# EAGLE design gorrazoptere_v0_9 (EAGLE 4.16)
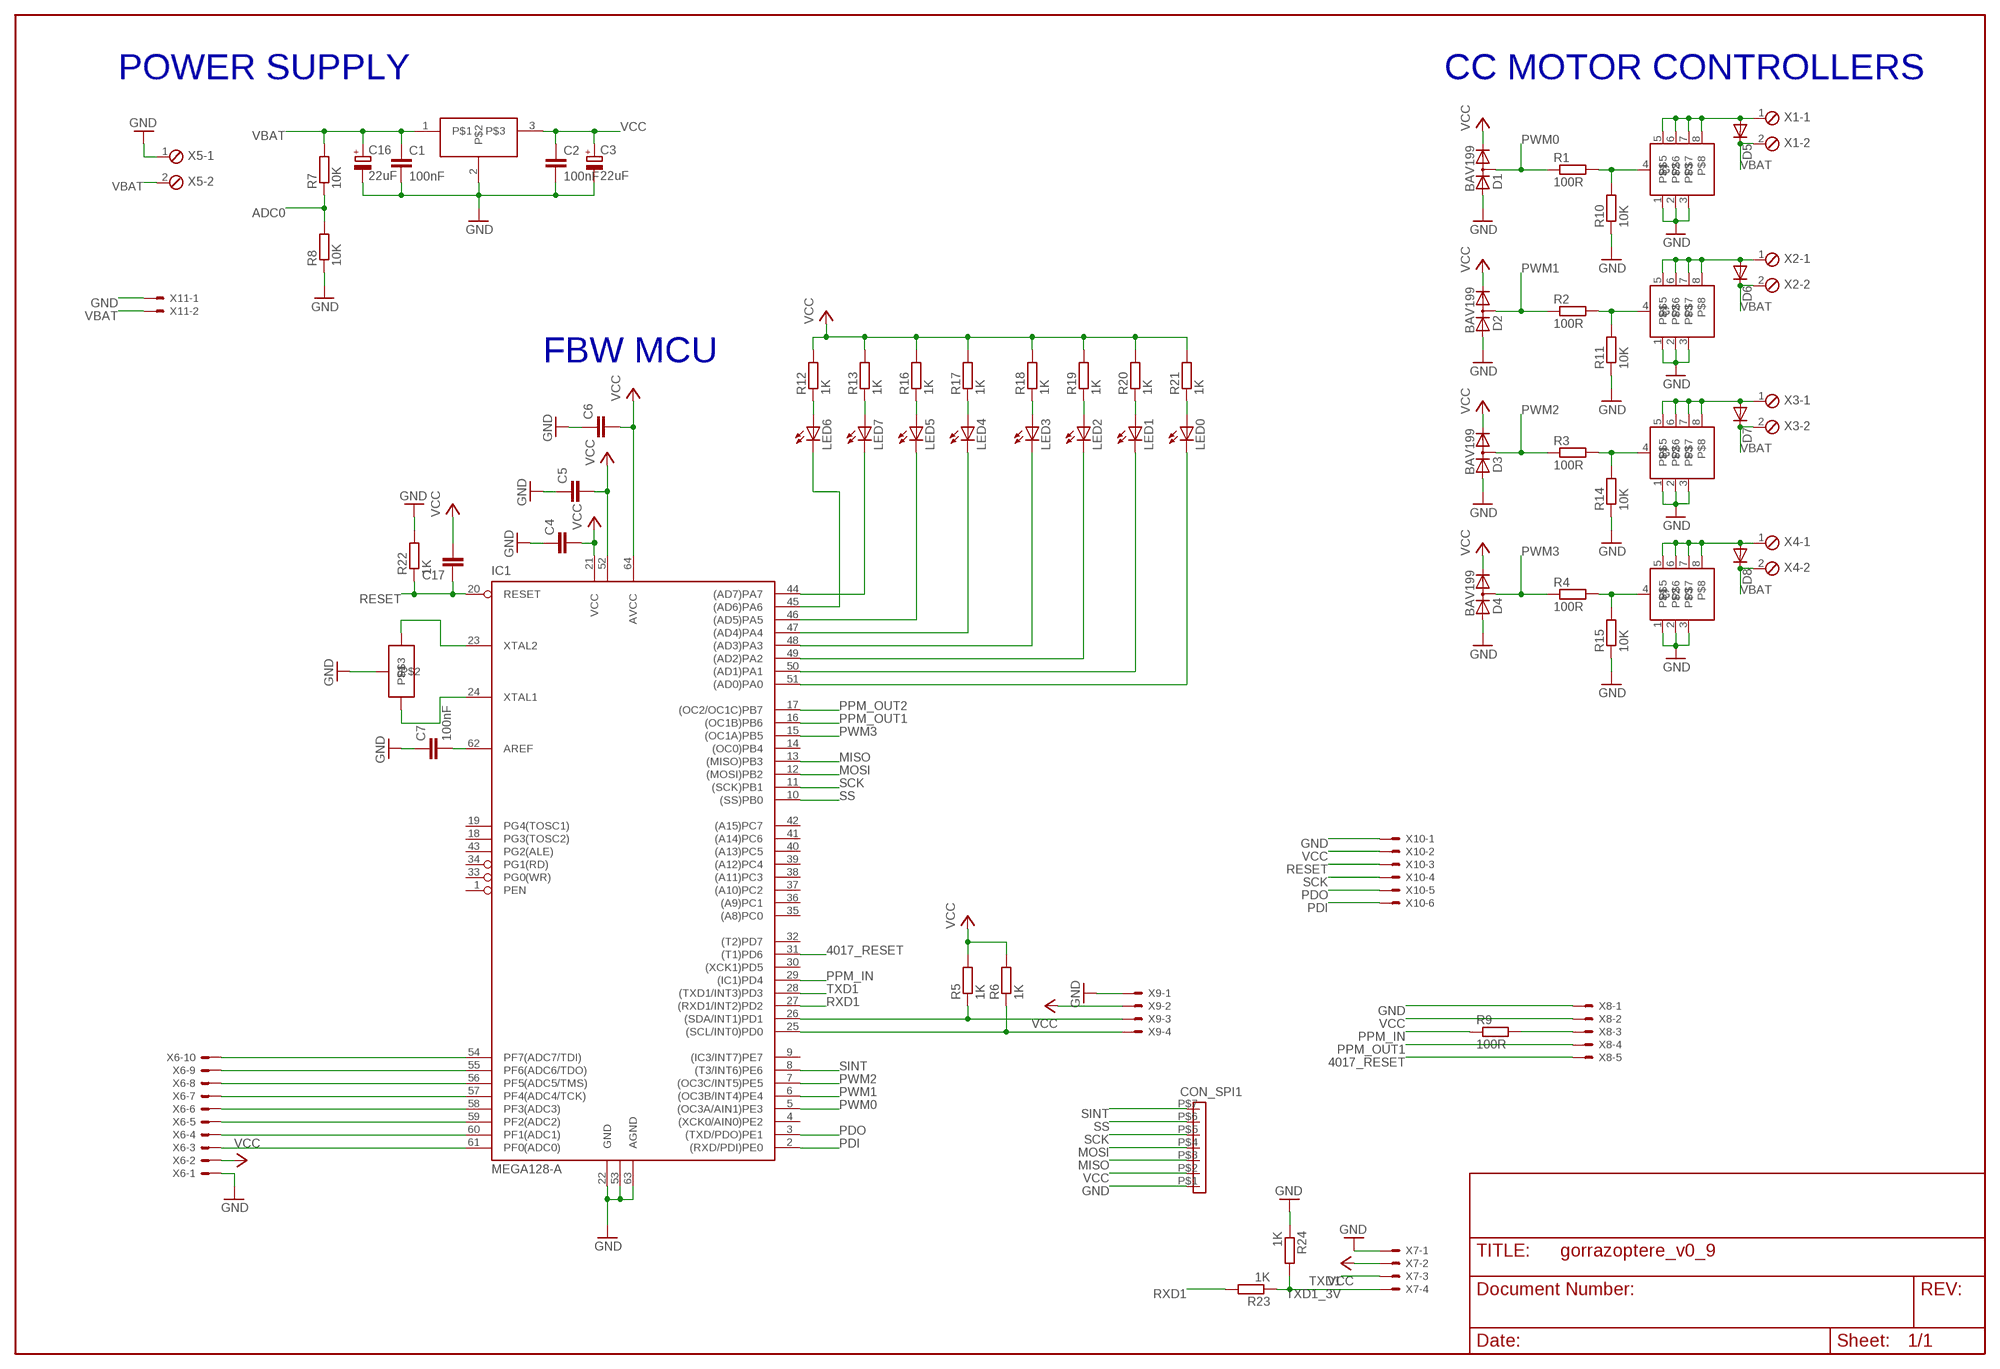
[diagram p0: schematic, sheet 1]

## Parts
C1  100nF  C-EUC0603  [C0603]
C2  100nF  C-EUC0603  [C0603]
C3  22uF  CPOL-EUD/7343-31R  [D/7343-31R]
C4  C-EUC0603  [C0603]
C5  C-EUC0603  [C0603]
C6  C-EUC0603  [C0603]
C7  100nF  C-EUC0603  [C0603]
C16  22uF  CPOL-EUD/7343-31R  [D/7343-31R]
C17  C-EUC0603  [C0603]
CON_SPI1  CON_MOLEX_7  [CON_MOLEX_7]
D1  BAV199  [SOT23]
D2  BAV199  [SOT23]
D3  BAV199  [SOT23]
D4  BAV199  [SOT23]
D5  DIODE-DO214BA  [DO-214BA]
D6  DIODE-DO214BA  [DO-214BA]
D7  DIODE-DO214BA  [DO-214BA]
D8  DIODE-DO214BA  [DO-214BA]
IC1  MEGA128-A  [TQFP64-AEB]
LED0  LEDCHIP-LED0805  [CHIP-LED0805]
LED1  LEDCHIP-LED0805  [CHIP-LED0805]
LED2  LEDCHIP-LED0805  [CHIP-LED0805]
LED3  LEDCHIP-LED0805  [CHIP-LED0805]
LED4  LEDCHIP-LED0805  [CHIP-LED0805]
LED5  LEDCHIP-LED0805  [CHIP-LED0805]
LED6  LEDCHIP-LED0805  [CHIP-LED0805]
LED7  LEDCHIP-LED0805  [CHIP-LED0805]
R1  100R  R-EU_R0603  [R0603]
R2  100R  R-EU_R0603  [R0603]
R3  100R  R-EU_R0603  [R0603]
R4  100R  R-EU_R0603  [R0603]
R5  1K  R-EU_R0603  [R0603]
R6  1K  R-EU_R0603  [R0603]
R7  10K  R-EU_R0603  [R0603]
R8  10K  R-EU_R0603  [R0603]
R9  100R  R-EU_R0603  [R0603]
R10  10K  R-EU_R0603  [R0603]
R11  10K  R-EU_R0603  [R0603]
R12  1K  R-EU_R0603  [R0603]
R13  1K  R-EU_R0603  [R0603]
R14  10K  R-EU_R0603  [R0603]
R15  10K  R-EU_R0603  [R0603]
R16  1K  R-EU_R0603  [R0603]
R17  1K  R-EU_R0603  [R0603]
R18  1K  R-EU_R0603  [R0603]
R19  1K  R-EU_R0603  [R0603]
R20  1K  R-EU_R0603  [R0603]
R21  1K  R-EU_R0603  [R0603]
R22  1K  R-EU_R0603  [R0603]
R23  1K  R-EU_R0603  [R0603]
R24  1K  R-EU_R0603  [R0603]
U$1  MICRO_RESO  [MICRO_CRYSTAL]
U$2  7805  [TO220H]
U$4  IRF7809  [SO08]
U$5  IRF7809  [SO08]
U$6  IRF7809  [SO08]
U$7  IRF7809  [SO08]
X1  MPT2  [2POL254]
X2  MPT2  [2POL254]
X3  MPT2  [2POL254]
X4  MPT2  [2POL254]
X5  MPT2  [2POL254]
X6  53047-10  [53047-10]
X7  53047-04  [53047-04]
X8  53047-05  [53047-05]
X9  53047-04  [53047-04]
X10  53047-06  [53047-06]
X11  53047-02  [53047-02]

## Nets
4017_RESET: IC1.31((T1)PD6) X8.5
ADC0: IC1.61(PF0(ADC0)) R7.1 R8.2 X6.3
ADC1: IC1.60(PF1(ADC1)) X6.4
ADC2: IC1.59(PF2(ADC2)) X6.5
ADC3: IC1.58(PF3(ADC3)) X6.6
ADC4: IC1.57(PF4(ADC4/TCK)) X6.7
ADC5: IC1.56(PF5(ADC5/TMS)) X6.8
ADC6: IC1.55(PF6(ADC6/TDO)) X6.9
ADC7: IC1.54(PF7(ADC7/TDI)) X6.10
GND: C1.2 C2.2 C3.- C4.1 C5.1 C6.1 C7.1 C16.- CON_SPI1.P$1 D1.1(A) D2.1(A) D3.1(A) D4.1(A) IC1.22(GND) IC1.53(GND1) IC1.63(AGND) R8.1 R10.1 R11.1 R14.1 R15.1 R22.2 R24.1 U$1.P$2 U$2.2 U$4.1 U$4.2 U$4.3 U$5.1 U$5.2 U$5.3 U$6.1 U$6.2 U$6.3 U$7.1 U$7.2 U$7.3 X5.1 X6.1 X7.1 X8.1 X9.1 X10.1 X11.1
MISO: CON_SPI1.P$3 IC1.13((MISO)PB3)
MOSI: CON_SPI1.P$4 IC1.12((MOSI)PB2)
N$1: IC1.23(XTAL2) U$1.P$3
N$2: IC1.24(XTAL1) U$1.P$1
N$3: IC1.26((SDA/INT1)PD1) R5.1 X9.3
N$4: IC1.25((SCL/INT0)PD0) R6.1 X9.4
N$5: IC1.45((AD6)PA6) LED6.C
N$7: R9.2 X8.3
N$9: R1.2 R10.2 U$4.4(G)
N$10: LED2.A R19.1
N$11: LED3.A R18.1
N$12: IC1.48((AD3)PA3) LED3.C
N$13: D5.A U$4.5 U$4.6 U$4.7 U$4.8 X1.1
N$14: D6.A U$5.5 U$5.6 U$5.7 U$5.8 X2.1
N$15: D7.A U$6.5 U$6.6 U$6.7 U$6.8 X3.1
N$16: D8.A U$7.5 U$7.6 U$7.7 U$7.8 X4.1
N$17: LED7.A R13.1
N$18: LED6.A R12.1
N$19: R2.2 R11.2 U$5.4(G)
N$20: R3.2 R14.2 U$6.4(G)
N$21: R4.2 R15.2 U$7.4(G)
N$22: LED4.A R17.1
N$23: C7.2 IC1.62(AREF)
N$25: IC1.44((AD7)PA7) LED7.C
N$26: LED5.A R16.1
N$27: IC1.46((AD5)PA5) LED5.C
N$28: IC1.47((AD4)PA4) LED4.C
N$29: IC1.49((AD2)PA2) LED2.C
N$30: LED0.A R21.1
N$31: LED1.A R20.1
N$32: IC1.50((AD1)PA1) LED1.C
N$33: IC1.51((AD0)PA0) LED0.C
PDI: IC1.2((RXD/PDI)PE0) X10.6
PDO: IC1.3((TXD/PDO)PE1) X10.5
PPM_IN: IC1.29((IC1)PD4) R9.1
PPM_OUT1: IC1.16((OC1B)PB6) X8.4
PPM_OUT2: IC1.17((OC2/OC1C)PB7)
PWM0: D1.3(AC) IC1.5((OC3A/AIN1)PE3) R1.1
PWM1: D2.3(AC) IC1.6((OC3B/INT4)PE4) R2.1
PWM2: D3.3(AC) IC1.7((OC3C/INT5)PE5) R3.1
PWM3: D4.3(AC) IC1.15((OC1A)PB5) R4.1
RESET: C17.1 IC1.20(RESET) R22.1 X10.3
RXD1: IC1.27((RXD1/INT2)PD2) R23.2
SCK: CON_SPI1.P$5 IC1.11((SCK)PB1) X10.4
SINT: CON_SPI1.P$7 IC1.8((T3/INT6)PE6)
SS: CON_SPI1.P$6 IC1.10((SS)PB0)
TXD1: IC1.28((TXD1/INT3)PD3) X7.3
TXD1_3V: R23.1 R24.2 X7.4
VBAT: C1.1 C16.+ D5.C D6.C D7.C D8.C R7.2 U$2.1 X1.2 X2.2 X3.2 X4.2 X5.2 X11.2
VCC: C2.1 C3.+ C4.2 C5.2 C6.2 C17.2 CON_SPI1.P$2 D1.2(C) D2.2(C) D3.2(C) D4.2(C) IC1.21(VCC) IC1.52(VCC1) IC1.64(AVCC) R5.2 R6.2 R12.2 R13.2 R16.2 R17.2 R18.2 R19.2 R20.2 R21.2 U$2.3 X6.2 X7.2 X8.2 X9.2 X10.2
Unconnected: IC1.1(PEN) IC1.4((XCK0/AIN0)PE2) IC1.9((IC3/INT7)PE7) IC1.14((OC0)PB4) IC1.18(PG3(TOSC2)) IC1.19(PG4(TOSC1)) IC1.30((XCK1)PD5) IC1.32((T2)PD7) IC1.33(PG0(WR)) IC1.34(PG1(RD)) IC1.35((A8)PC0) IC1.36((A9)PC1) IC1.37((A10)PC2) IC1.38((A11)PC3) IC1.39((A12)PC4) IC1.40((A13)PC5) IC1.41((A14)PC6) IC1.42((A15)PC7) IC1.43(PG2(ALE))

## Notes on the sheet
- POWER SUPPLY | CC MOTOR CONTROLLERS
- FBW MCU

## Library data of the parts
C1 C2 C4-C7 C17 = rcl:C-EU: CAPACITOR, European symbol
C3 C16 = rcl:CPOL-EU: POLARIZED CAPACITOR, European symbol
CON_SPI1 = misc_datalogger:CON_MOLEX_7
D1-D4 = diode:BAV199: DIODE low-leakage double diode
D5-D8 = diode:DIODE-: DIODE
IC1 = atmel:MEGA128: MICROCONTROLLER 128 Kbytes FLASH 4 Kbytes SRAM 4 Kbytes EEPROM DUAL USART 8-channel 10 bit ADC
LED0 LED1-LED7 = led:LED: LED OSRAM: - CHIPLED LG R971, LG N971, LY N971, LG Q971, LY Q971, LO R971, LY R971 LH N974, LH R974 LS Q976, LO Q976, LY Q976 LO Q996 - Hyper CHIPLED LW Q18S LB Q993, LB Q99A, LB R99A - SideLED LS A670, LO A670, LY A670, LG A670, LP A670 LB A673, LV A673, LT A673, LW A673 LH A674 LY A675 LS A676, LA A676, LO A676, LY A676, LW A676 LS A679, LY A679, LG A679 - Hyper Micro SIDELED® LS Y876, LA Y876, LO Y876, LY Y876 LT Y87S - SmartLED LW L88C, LW L88S LB L89C, LB L89S, LG L890 LS L89K, LO L89K, LY L89K LS L896, LA L896, LO L896, LY L896 - TOPLED LS T670, LO T670, LY T670, LG T670, LP T670 LSG T670, LSP T670, LSY T670, LOP T670, LYG T670 LG T671, LOG T671, LSG T671 LB T673, LV T673, LT T673, LW T673 LH T674 LS T676, LA T676, LO T676, LY T676, LB T676, LH T676, LSB T676, LW T676 LB T67C, LV T67C, LT T67C, LS T67K, LO T67K, LY T67K, LW E67C LS E67B, LA E67B, LO E67B, LY E67B, LB E67C, LV E67C, LT E67C LW T67C LS T679, LY T679, LG T679 LS T770, LO T770, LY T770, LG T770, LP T770 LB T773, LV T773, LT T773, LW T773 LH T774 LS E675, LA E675, LY E675, LS T675 LS T776, LA T776, LO T776, LY T776, LB T776 LHGB T686 LT T68C, LB T68C - Hyper Mini TOPLED® LB M676 - Mini TOPLED Santana® LG M470 LS M47K, LO M47K, LY M47K Source: http://www.osram.convergy.de/
R1-R24 = rcl:R-EU_: RESISTOR, European symbol
U$1 = paparazzi:MICRO_RESO
U$2 = paparazzi:7805
U$4-U$7 = paparazzi:IRF7809
X1-X5 = con-phoenix-254:MPT2: PHOENIX CONNECTOR
X6 = con-molex:53?-10: CONNECTOR wire to board 1.25 mm (.049 inch) pitch header
X7 X9 = con-molex:53?-04: CONNECTOR wire to board 1.25 mm (.049 inch) pitch header
X8 = con-molex:53?-05: CONNECTOR wire to board 1.25 mm (.049 inch) pitch header
X10 = con-molex:53?-06: CONNECTOR wire to board 1.25 mm (.049 inch) pitch header
X11 = con-molex:53?-02: CONNECTOR wire to board 1.25 mm (.049 inch) pitch header

## Board
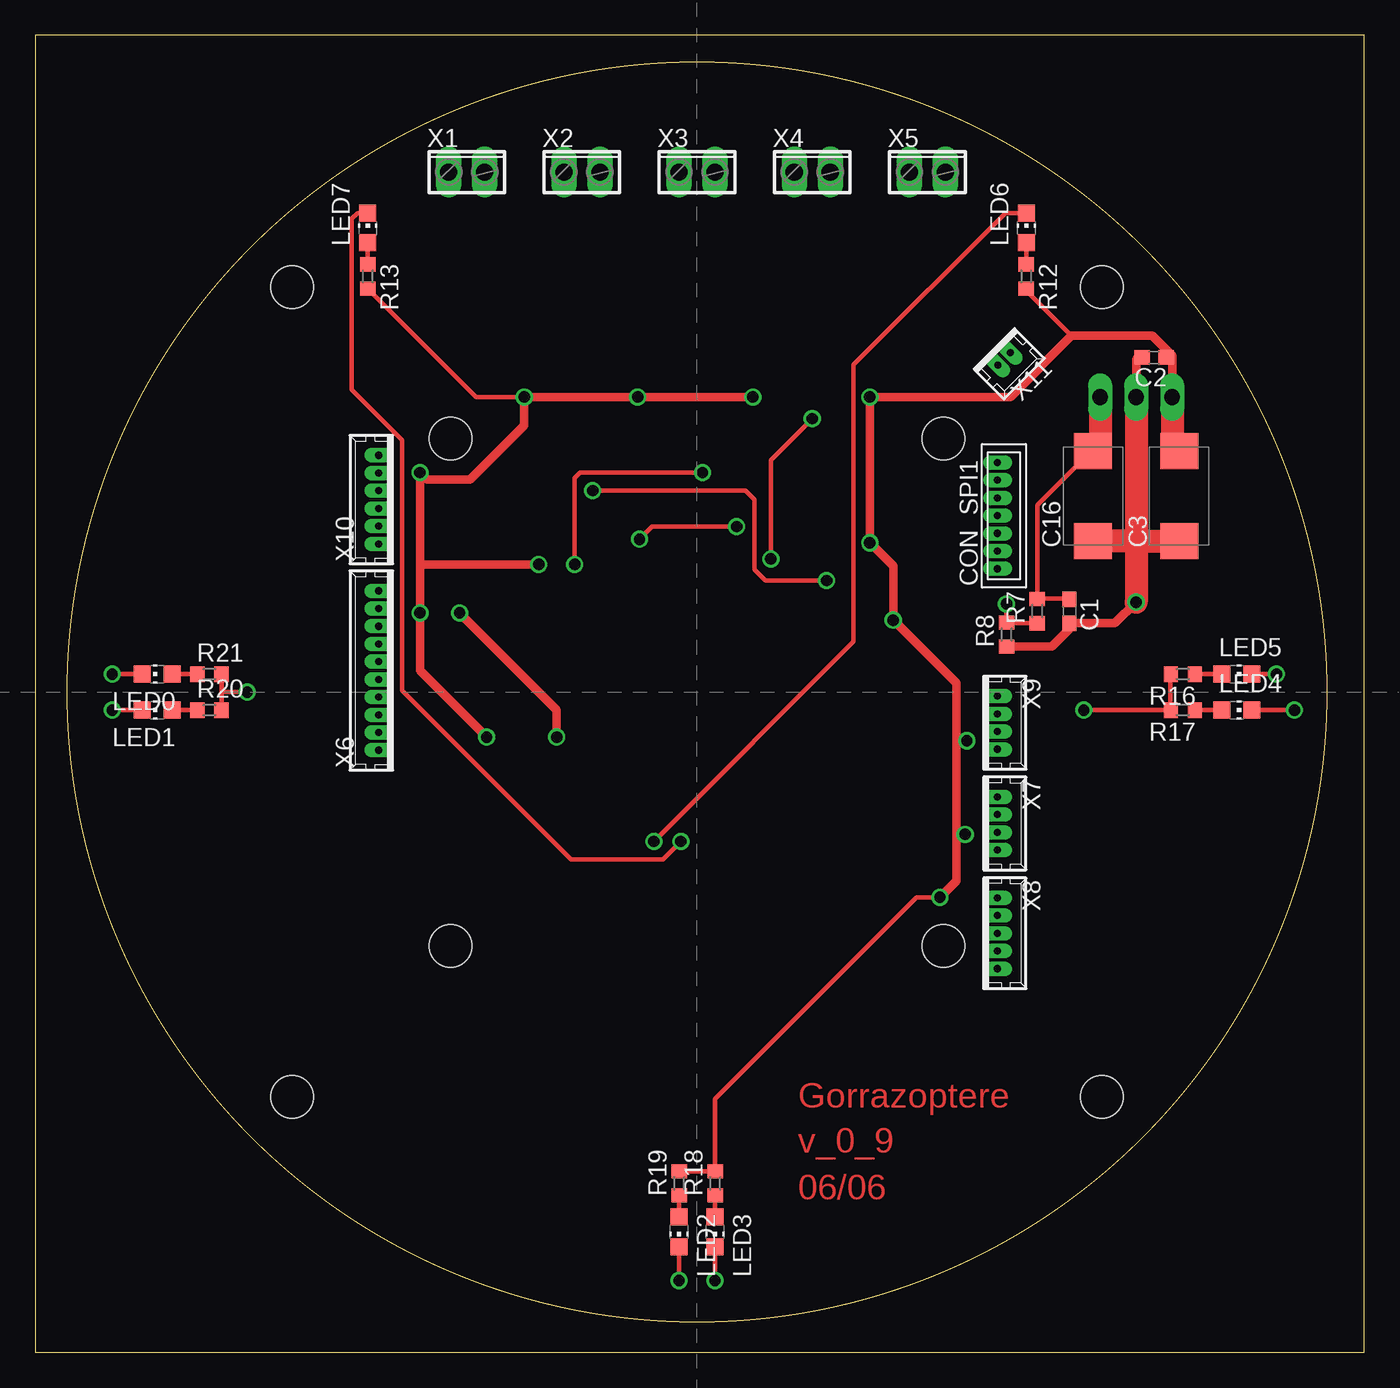
[diagram p1: board, top side]
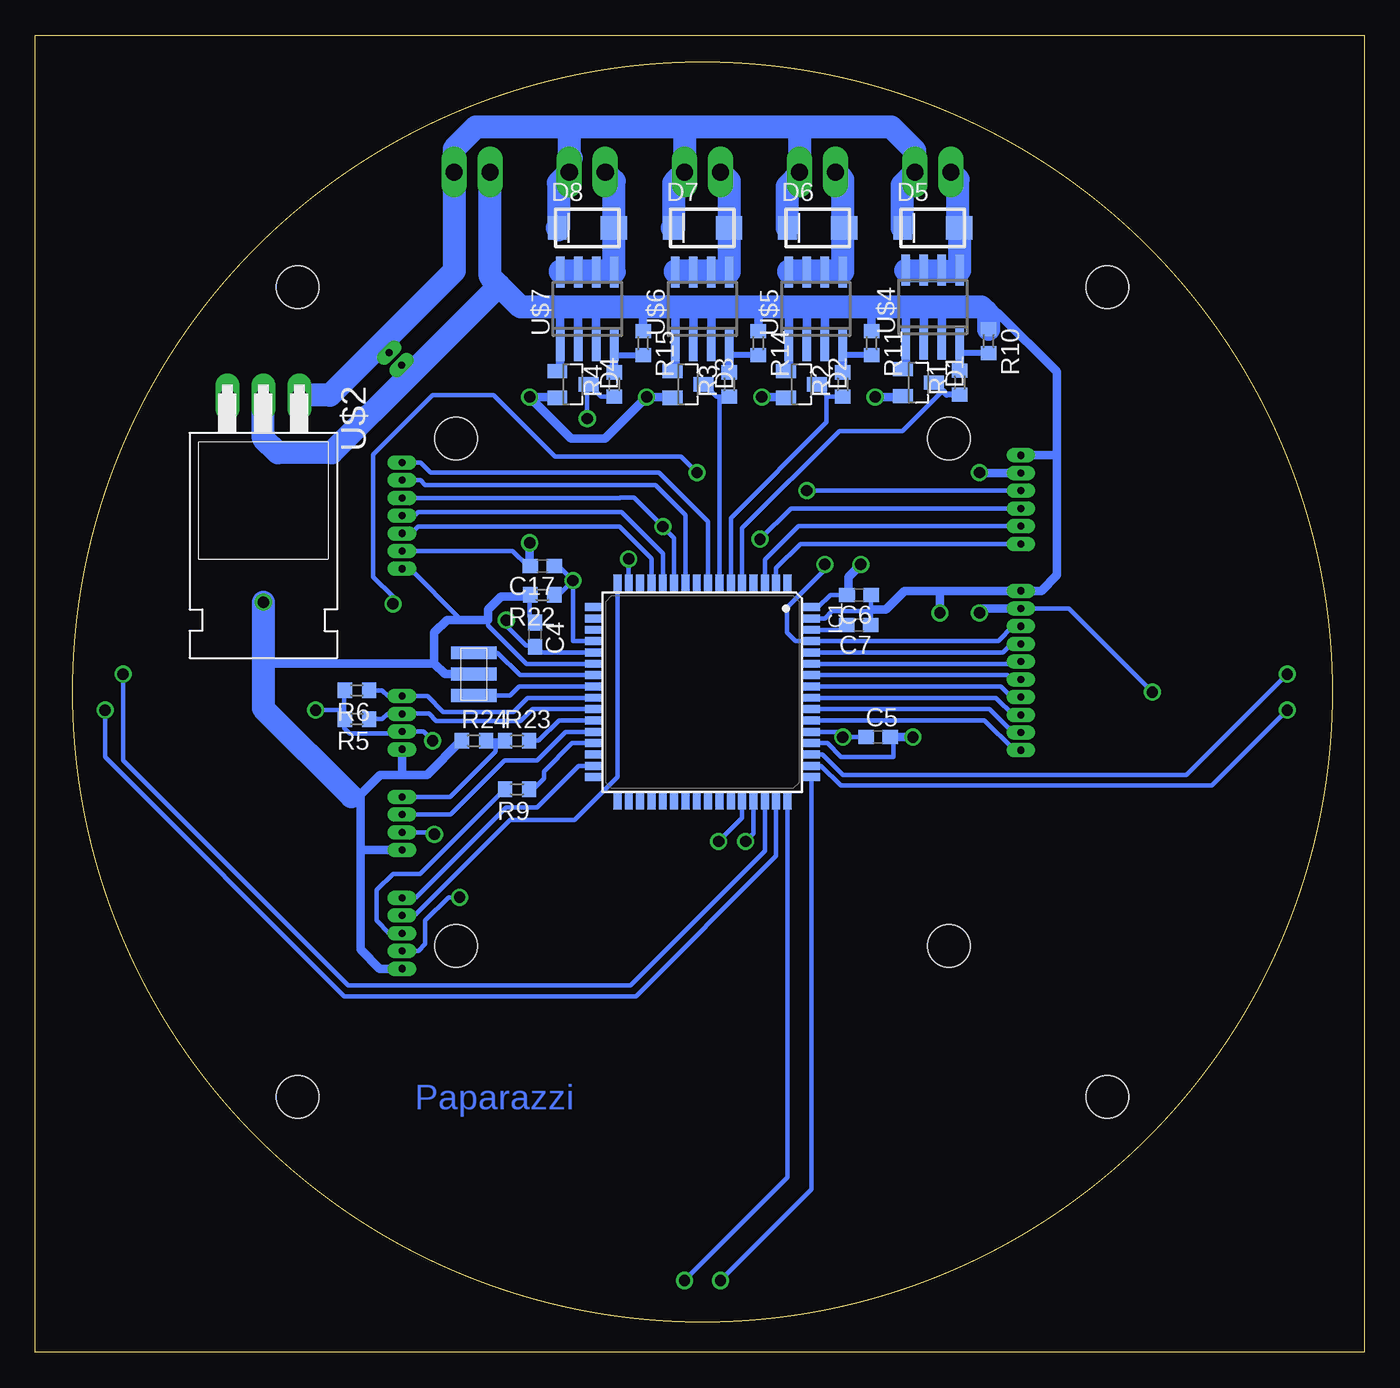
[diagram p2: board, bottom side, seen from below]

Size 93.78 x 92.95 mm. Coordinates in mm from the lower left corner, seen from the top.
Outline: 0,0 93.78,0 93.78,92.95 0,92.95 0,0
Outline: circle at 46.7,46.6 radius 44.45
Copper layers (1*16): Top 0.035mm / dielectric 1.5mm / Bottom 0.035mm
Design rules "default": minimum track width 10mil, minimum drill 24mil, track to track 8mil, track to pad 8mil, pad to pad 8mil, via to via 8mil, smd to smd 8mil, copper to edge 40mil, drill to drill 8mil, minimum pad ring 10mil, minimum via ring 8mil, stop-mask expansion 4mil, vias tented up to drill 0mil, thermal gap 10mil
Holes 3 mm at 18.12,75.18 75.27,75.18 75.27,18.03 18.12,18.03 29.3,64.51 64.1,64.51 64.1,28.7 29.3,28.7

### Footprints (pad centres in the part's own frame; a part is rotated, then mirrored left to right if it is on the bottom)
C0603 = smd 1.1 x 1: 1 -0.85,0; 2 0.85,0
D/7343-31R = smd 2.55 x 2.7: + 3.175,0; - -3.175,0
CON_MOLEX_7 = drill 0.5 pad 0.762 long: P$1 -3.74,0; P$2 -2.49,0; P$3 -1.24,0; P$4 0.01,0; P$5 1.26,0; P$6 2.51,0; P$7 3.76,0
SOT23 = smd 1 x 1.4: 1 -0.95,-1.1; 2 0.95,-1.1; 3 0,1.1
DO-214BA = smd 1.85 x 1.68: A 1.87,0 | smd 1.32 x 1.68: C -2.12,0
TQFP64-AEB = smd 1.194 x 0.559: 1 -7.7,6; 2 -7.7,5.2; 3 -7.7,4.4; 4 -7.7,3.6; 5 -7.7,2.8; 6 -7.7,2; 7 -7.7,1.2; 8 -7.7,0.4; 9 -7.7,-0.4; 10 -7.7,-1.2; 11 -7.7,-2; 12 -7.7,-2.8; 13 -7.7,-3.6; 14 -7.7,-4.4; 15 -7.7,-5.2; 16 -7.7,-6; 33 7.7,-6; 34 7.7,-5.2; 35 7.7,-4.4; 36 7.7,-3.6; 37 7.7,-2.8; 38 7.7,-2; 39 7.7,-1.2; 40 7.7,-0.4; 41 7.7,0.4; 42 7.7,1.2; 43 7.7,2; 44 7.7,2.8; 45 7.7,3.6; 46 7.7,4.4; 47 7.7,5.2; 48 7.7,6 | smd 0.559 x 1.194: 17 -6,-7.7; 18 -5.2,-7.7; 19 -4.4,-7.7; 20 -3.6,-7.7; 21 -2.8,-7.7; 22 -2,-7.7; 23 -1.2,-7.7; 24 -0.4,-7.7; 25 0.4,-7.7; 26 1.2,-7.7; 27 2,-7.7; 28 2.8,-7.7; 29 3.6,-7.7; 30 4.4,-7.7; 31 5.2,-7.7; 32 6,-7.7; 49 6,7.7; 50 5.2,7.7; 51 4.4,7.7; 52 3.6,7.7; 53 2.8,7.7; 54 2,7.7; 55 1.2,7.7; 56 0.4,7.7; 57 -0.4,7.7; 58 -1.2,7.7; 59 -2,7.7; 60 -2.8,7.7; 61 -3.6,7.7; 62 -4.4,7.7; 63 -5.2,7.7; 64 -6,7.7
CHIP-LED0805 = smd 1.2 x 1.2: A 0,-1.05; C 0,1.05
R0603 = smd 1 x 1.1: 1 -0.85,0; 2 0.85,0
MICRO_CRYSTAL = smd 0.9 x 3.2: P$1 -1.5,0; P$2 0,0; P$3 1.5,0
TO220H = drill 1.118 long: 1 -2.54,-10.16; 2 0,-10.16; 3 2.54,-10.16
SO08 = smd 0.6 x 2.2: 1 -1.905,-2.6; 2 -0.635,-2.6; 3 0.635,-2.6; 4 1.905,-2.6; 5 1.905,2.6; 6 0.635,2.6; 7 -0.635,2.6; 8 -1.905,2.6
2POL254 = drill 1.2 long: 1 -1.27,0; 2 1.27,0
53047-10 = drill 0.5 pad 0.698 long: 1 5.625,0; 2 4.375,0; 3 3.125,0; 4 1.875,0; 5 0.625,0; 6 -0.625,0; 7 -1.875,0; 8 -3.125,0; 9 -4.375,0; 10 -5.625,0
53047-04 = drill 0.5 pad 0.698 long: 1 1.875,0; 2 0.625,0; 3 -0.625,0; 4 -1.875,0
53047-05 = drill 0.5 pad 0.698 long: 1 2.5,0; 2 1.25,0; 3 0,0; 4 -1.25,0; 5 -2.5,0
53047-06 = drill 0.5 pad 0.698 long: 1 3.125,0; 2 1.875,0; 3 0.625,0; 4 -0.625,0; 5 -1.875,0; 6 -3.125,0
53047-02 = drill 0.5 pad 0.698 long: 1 0.625,0; 2 -0.625,0

### Placement (x,y rotation side)
C1  72.99,52.32 270 top
C2  78.96,70.23 180 top
C3  80.73,60.45 90 top
C4  58.51,50.67 270 bottom
C5  34.3,43.43 0 bottom
C6  35.65,53.46 180 bottom
C7  35.66,51.34 180 bottom
C16  74.64,60.45 90 top
C17  58,55.49 180 bottom
CON_SPI1  67.91,59.05 90 top
D1  31.46,68.45 270 bottom
D2  39.71,68.32 270 bottom
D3  47.71,68.32 270 bottom
D4  55.84,68.32 270 bottom
D5  30.44,79.37 0 bottom
D6  38.57,79.37 0 bottom
D7  46.7,79.37 0 bottom
D8  54.83,79.37 0 bottom
IC1  46.7,46.6 270 bottom
LED0  8.6,47.87 90 top
LED1  8.6,45.33 90 top
LED2  45.43,8.5 180 top
LED3  47.97,8.5 180 top
LED4  84.8,45.33 270 top
LED5  84.8,47.87 270 top
LED6  69.94,79.37 0 top
LED7  23.46,79.37 0 top
R1  28.54,68.45 90 bottom
R2  36.79,68.32 90 bottom
R3  44.79,68.32 90 bottom
R4  52.92,68.32 90 bottom
R5  71.08,44.7 180 bottom
R6  71.08,46.73 180 bottom
R7  70.7,52.32 90 top
R8  68.54,50.67 90 top
R9  59.78,39.75 180 bottom
R10  26.5,71.37 270 bottom
R11  34.76,71.24 270 bottom
R12  69.94,75.94 270 top
R13  23.46,75.94 270 top
R14  42.76,71.24 270 bottom
R15  50.89,71.24 270 bottom
R16  80.99,47.87 180 top
R17  80.99,45.33 180 top
R18  47.97,11.93 90 top
R19  45.43,11.93 90 top
R20  12.28,45.33 0 top
R21  12.28,47.87 0 top
R22  58,53.46 180 bottom
R23  59.78,43.18 0 bottom
R24  62.83,43.18 0 bottom
U$1  62.83,47.87 90 bottom
U$2  77.69,57.27 180 bottom
U$4  30.44,73.78 0 bottom
U$5  38.7,73.66 0 bottom
U$6  46.7,73.66 0 bottom
U$7  54.83,73.66 0 bottom
X1  30.44,83.31 0 top
X2  38.57,83.31 0 top
X3  46.7,83.31 0 top
X4  54.83,83.31 0 top
X5  62.95,83.31 0 top
X6  24.22,48.13 90 top
X7  67.91,37.33 270 top
X8  67.91,29.59 270 top
X9  67.91,44.45 270 top
X10  24.22,60.19 90 top
X11  68.38,70.14 225 top

### Tracks (layer width: path | path; a pad name or v marks a point on that pad's centre or on a via)
4017_RESET
  Bottom 0.305: IC1.31 55.45,41.4 58.38,38.48 60.54,38.48 66.93,32.09 X8.5
ADC0  (via drill 0.8)
  Top 0.305: R8.2 68.58,51.52 68.67,51.43 68.71,51.47 R7.1 | 68.41,51.56 68.5,51.56 R8.2 | v38.06,55.62 38.06,61.72 38.44,62.1 v47.08,62.1 | v68.54,52.83 R8.2
  Bottom 0.305: X6.3 24.78,51.25 25.83,50.2 IC1.61 40.14,50.2 40.73,50.8 40.73,52.57 38.06,55.24 v38.06,55.62 | v68.54,52.83 68.54,53.34 69.94,54.73 69.94,63.37 65.75,67.56 61.43,67.56 57.11,63.24 48.22,63.24 v47.08,62.1
ADC1
  Bottom 0.305: X6.4 24.88,50 25.48,49.4 IC1.60
ADC2
  Bottom 0.305: X6.5 24.38,48.6 IC1.59
ADC3
  Bottom 0.305: IC1.58 25.16,47.8 24.85,47.49 24.22,47.49 X6.6
ADC4
  Bottom 0.305: IC1.57 25.64,47 24.85,46.22 24.22,46.22 X6.7
ADC5
  Bottom 0.305: IC1.56 25.98,46.2 24.73,44.95 24.22,44.95 X6.8
ADC6
  Bottom 0.305: IC1.55 26.45,45.4 24.85,43.81 24.22,43.81 X6.9
ADC7
  Bottom 0.305: IC1.54 26.79,44.6 24.73,42.54 24.22,42.54 X6.10
GND  (via drill 0.8)
  Top 0.61: v36.79,43.43 36.79,45.33 v29.93,52.19 | C2.2 78.07,70.23 77.94,70.35 77.69,70.1 U$2.2 | R8.1 71.76,49.82 72.99,51.05 C1.2 76.2,51.47 v77.69,52.95
  Top 1.626: 77.69,57.27 77.18,57.27 | 77.18,57.27 C16.- | 77.18,57.27 C3.- | 77.69,57.27 v77.69,52.95 | U$2.2 77.69,57.27
  Bottom 0.305: IC1.53 37.17,43.8 v36.79,43.43 C5.1 | C6.1 34.89,53.46 34.81,53.39 34.81,52.45 34.81,52.32 | 34.81,52.32 C7.1 | IC1.63 38.07,51.8 37.55,52.32 34.81,52.32 | R22.2 58.89,53.46 58.89,53.34 58.89,51.9 C4.1 | IC1.22 59.11,48.6 61.81,51.3 61.81,51.68 | 63.84,51.68 63.84,51.81 67.34,55.31 CON_SPI1.P$1 | X11.1 67.32,69.08 67.27,69.08
  Bottom 0.61: 54.19,70.99 U$7.3 54.19,73.78 | D1.1 arc-90 32.35,69.61 U$4.1 32.35,73.78 | 40.6,71.11 U$5.1 | D2.1 arc-90 40.6,69.48 40.6,71.11 | D3.1 arc-90 48.6,69.48 U$6.1 48.6,73.78 | D4.1 arc-90 56.73,69.48 U$7.1 56.73,73.78 | 29.81,73.78 U$4.3 | 31.08,73.78 U$4.2 | 34.76,73.78 R11.1 | 38.06,73.78 U$5.3 | 39.33,73.78 U$5.2 | 40.6,73.78 40.6,71.11 | 42.76,73.78 R14.1 | 46.06,73.78 U$6.3 | 47.33,73.78 U$6.2 | 50.89,73.78 R15.1 | 55.46,73.78 U$7.2 | 21.68,63.37 21.68,54.86 22.79,53.75 X6.1 29.93,53.75 | 21.68,63.37 21.68,69.21 25.87,73.4 26.5,73.4 26.57,73.34 | X10.1 21.73,63.32 21.68,63.37 | 29.93,53.75 32.44,53.75 33.74,52.45 34.81,52.45 | 29.93,53.75 v29.93,52.19 | X8.1 69.47,27.09 70.83,28.44 70.83,35.43 | X7.1 70.8,35.46 70.83,35.43 | R24.1 63.72,43.18 66.13,40.76 67.91,40.76 | 70.83,39.24 70.83,35.43 | 70.83,39.24 70.83,39.37 69.43,40.76 67.91,40.76 | 67.91,40.76 X9.1 | 71.46,39.24 70.83,39.24 | 77.69,48.64 65.62,48.64 | U$1.P$2 64.86,47.87 65.62,48.64 | 65.62,48.64 65.62,50.8 64.73,51.68 63.84,51.68 61.81,51.68 61.81,52.45 60.92,53.34 58.89,53.34 58.85,53.37 R22.2
  Bottom 1.626: R10.1 26.5,73.27 26.57,73.34 27.01,73.78 29.81,73.78 31.08,73.78 32.35,73.78 34.76,73.78 38.06,73.78 39.33,73.78 40.6,73.78 42.76,73.78 46.06,73.78 47.33,73.78 48.6,73.78 50.89,73.78 54.19,73.78 55.46,73.78 56.73,73.78 59.52,73.78 61.05,75.31 | X5.1 61.68,75.94 61.05,75.31 | U$2.2 77.69,66.8 | 61.05,75.31 67.27,69.08 72.86,63.49 76.67,63.49 77.69,64.51 U$2.2 | U$2.2 77.69,67.56 | v77.69,52.95 77.69,48.64 77.69,45.46 71.46,39.24
MISO
  Bottom 0.305: IC1.13 50.3,56.05 52.54,58.29 66.76,58.29 67.27,57.78 67.91,57.78 CON_SPI1.P$3
MOSI
  Bottom 0.305: IC1.12 49.5,56.39 52.41,59.3 66.76,59.3 67.02,59.05 CON_SPI1.P$4
N$1
  Bottom 0.305: IC1.23 59.58,47.8 61.15,49.37 U$1.P$3
N$2
  Bottom 0.305: IC1.24 59.63,47 60.29,46.35 62.7,46.35 62.72,46.37 U$1.P$1
N$3
  Bottom 0.305: 70.32,44.7 R5.1 69.3,44.7 68.93,45.07 X9.3 67.91,45.08 66,45.08 65.49,44.57 59.52,44.57 58.69,45.4 IC1.26
N$4
  Bottom 0.305: R6.1 69.3,46.73 68.89,46.32 X9.4 66.1,46.32 64.99,45.21 60.03,45.21 59.04,46.2 IC1.25
N$5  (via drill 0.8)
  Top 0.305: LED6.C 68.45,80.42 57.75,69.72 57.75,50.16 v43.65,36.06
  Bottom 0.305: IC1.45 43.1,36.62 v43.65,36.06
N$7
  Bottom 0.305: X8.3 68.8,29.59 69.68,30.47 69.68,32.63 68.54,33.78 66.64,33.78 60.67,39.75 R9.2
N$9
  Bottom 0.406: R10.2 28.5,70.52 28.54,70.48
  Bottom 0.61: R1.2 28.54,70.48 U$4.4
N$10
  Top 0.305: LED2.A R19.1
N$11
  Top 0.305: LED3.A R18.1
N$12  (via drill 0.8)
  Top 0.305: 47.97,7.62 LED3.C v47.97,5.08
  Bottom 0.305: IC1.48 40.7,12.35 v47.97,5.08
N$13
  Bottom 1.626: U$4.6 29.81,76.32 | U$4.6 29.87,76.32 31.02,76.32 U$4.7 31.14,76.32 32.29,76.32 U$4.8 | X1.1 28.66,82.8 28.66,79.37 D5.A 28.66,79.28 28.54,79.15 U$4.5 28.6,76.32 29.75,76.32 U$4.6
N$14
  Bottom 1.626: X2.1 36.79,82.8 36.79,79.37 D6.A 36.79,79.28 U$5.5 36.86,76.32 38.06,76.32 U$5.6 38.13,76.32 39.33,76.32 U$5.7 39.4,76.32 40.6,76.32 U$5.8
N$15
  Bottom 1.626: X3.1 44.79,82.67 44.79,79.41 D7.A 44.79,79.33 U$6.5 44.86,76.32 46.06,76.32 U$6.6 46.13,76.32 47.33,76.32 U$6.7 47.4,76.32 48.6,76.32 U$6.8
N$16
  Bottom 1.626: X4.1 52.92,82.67 52.92,79.41 D8.A 52.92,79.33 U$7.5 52.99,76.32 54.26,76.32 | 54.26,76.32 54.32,76.32 | 55.53,76.32 55.59,76.32 | 54.26,76.32 U$7.6 | 54.26,76.32 55.53,76.32 | U$7.8 56.73,76.32 55.53,76.32 | 55.53,76.32 U$7.7
N$17
  Top 0.305: 23.46,78.35 LED7.A R13.1
N$18
  Top 0.305: 69.85,78.32 69.81,78.35 | LED6.A 69.85,78.32 | R12.1 69.94,78.23 69.85,78.32
N$19
  Bottom 0.406: R11.2 36.75,70.39 36.79,70.35
  Bottom 0.61: R2.2 36.79,70.35 U$5.4
N$20
  Bottom 0.406: R14.2 44.75,70.39 44.79,70.35
  Bottom 0.61: R3.2 44.79,70.35 U$6.4
N$21
  Bottom 0.406: R15.2 52.88,70.39 52.92,70.35
  Bottom 0.61: R4.2 52.92,70.35 U$7.4
N$22
  Top 0.305: 83.78,45.33 LED4.A R17.1
N$23
  Bottom 0.305: C7.2 36.84,51 IC1.62
N$25  (via drill 0.8)
  Top 0.305: LED7.C 22.73,80.42 22.31,80 22.31,67.94 25.87,64.38 25.87,46.73 37.81,34.79 44.29,34.79 v45.55,36.06
  Bottom 0.305: IC1.44 43.9,37.72 v45.55,36.06
N$26
  Top 0.305: 83.78,47.87 LED5.A R16.1
N$27  (via drill 0.8)
  Top 0.305: v87.59,47.87 LED5.C
  Bottom 0.305: IC1.46 42.3,35.38 51.78,25.9 71.72,25.9 87.59,41.78 v87.59,47.87
N$28  (via drill 0.8)
  Top 0.305: 85.81,45.33 LED4.C v88.86,45.33
  Bottom 0.305: IC1.47 41.5,35.04 51.4,25.14 71.97,25.14 88.86,42.03 v88.86,45.33
N$29  (via drill 0.8)
  Top 0.305: 45.43,7.49 LED2.C v45.43,5.08
  Bottom 0.305: IC1.49 39,11.51 v45.43,5.08
N$30
  Top 0.305: LED0.A R21.1
N$31
  Top 0.305: 11.52,45.33 R20.1 LED1.A
N$32  (via drill 0.8)
  Top 0.305: 7.58,45.33 LED1.C v5.42,45.33
  Bottom 0.305: IC1.50 38.32,41.4 36.92,40 10.76,40 v5.42,45.33
N$33  (via drill 0.8)
  Top 0.305: 7.58,47.87 LED0.C v5.42,47.87
  Bottom 0.305: IC1.51 38.23,42.2 36.79,40.76 12.54,40.76 v5.42,47.87
PDI
  Bottom 0.305: X10.6 39.79,57.07 41.5,55.36 IC1.2
PDO
  Bottom 0.305: X10.5 39.94,58.32 42.3,55.96 IC1.3
PPM_IN
  Bottom 0.305: IC1.29 55.89,43 57.87,41.02 57.87,40.51 58.64,39.75 R9.1
PPM_OUT1
  Bottom 0.305: IC1.16 52.7,40.6 55.72,37.59 60.29,37.59 67.02,30.86 67.91,30.86 X8.4
PWM0
  Bottom 0.305: R1.1 28.54,67.56 | IC1.5 43.9,58.17 37.05,65.02 32.6,65.02 29.74,67.88
  Bottom 0.406: D1.3 30.32,68.45 29.74,67.88 29.46,67.6 R1.1
PWM1
  Bottom 0.305: D2.3 38.7,68.32 37.94,67.56 | R2.1 37.85,67.47 37.94,67.56 | IC1.6 44.7,58.89 37.94,65.65 37.94,67.56
PWM2
  Bottom 0.305: 44.79,67.43 R3.1 45.43,67.47 | D3.3 46.57,68.32 45.72,67.47 45.43,67.47 | 45.43,67.47 45.43,67.43 45.5,67.36 IC1.7
PWM3  (via drill 0.8)
  Top 0.305: v51.91,56 51.91,62.99 v54.83,65.91
  Bottom 0.305: 52.92,67.56 R4.1 53.85,67.47 54.7,68.32 D4.3 54.83,68.32 v54.83,65.91 | IC1.15 51.9,56 v51.91,56
RESET  (via drill 0.8)
  Top 0.305: v39.33,60.83 50.13,60.83 50.76,60.19 50.76,55.24 51.52,54.48 v55.84,54.48
  Bottom 0.305: X10.3 39.32,60.82 v39.33,60.83 | v55.84,54.48 56.86,55.49 C17.1 | v55.84,54.48 56.86,53.46 R22.1 | IC1.20 55.84,50.2 v55.84,54.48
RXD1
  Bottom 0.305: IC1.27 56.83,44.6 58.26,43.18 R23.2 59.02,43.18
SCK  (via drill 0.8)
  Top 0.305: v42.63,57.4 43.52,58.29 v49.49,58.29
  Bottom 0.305: X10.4 40.47,59.57 v42.63,57.4 | CON_SPI1.P$5 52.53,60.31 52.52,60.32 51.52,60.32 v49.49,58.29 48.7,57.49 IC1.11
SINT
  Bottom 0.305: IC1.8 46.3,58.65 49.75,62.1 65.88,62.1 66.59,62.81 CON_SPI1.P$7
SS
  Bottom 0.305: IC1.10 47.9,59.11 50,61.21 66.26,61.21 66.61,61.56 CON_SPI1.P$6
TXD1
  Bottom 0.305: IC1.28 56.36,43.8 58.38,41.78 60.67,41.78 64.49,37.96 X7.3
TXD1_3V
  Bottom 0.305: X7.4 64.51,39.21 61.3,42.41 61.3,43.18 | R23.1 61.3,43.18 | 62.06,43.18 R24.2 61.3,43.18
VBAT
  Top 0.305: 74.51,63.62 70.7,59.81 R7.2 70.74,53.21 72.99,53.21 C1.1
  Top 1.626: C16.+ 74.51,63.62 75.15,64.26 U$2.1
  Bottom 0.305: 69.37,71.18 69.43,71.24 69.43,71.19 X11.2
  Bottom 1.626: 39.84,86.48 X2.2 39.84,83.18 40.73,82.29 40.73,79.37 D6.C | 47.97,86.48 X3.2 48.73,82.55 48.73,79.37 D7.C | 39.84,86.48 47.97,86.48 | 56.1,84.32 56.1,86.48 55.97,86.48 | 56.1,84.32 X4.2 56.86,82.55 56.86,79.28 | 47.97,86.48 55.97,86.48 | 56.1,84.32 55.97,84.32 | D5.C 32.6,79.37 32.6,82.42 X1.2 31.71,84.83 33.36,86.48 39.84,86.48 | 56.86,79.28 56.86,79.24 | 56.86,79.28 D8.C | 55.97,86.48 62.7,86.48 64.22,84.96 X5.2 64.22,76.32 69.37,71.18 72.99,67.56 75.15,67.56 U$2.1
VCC  (via drill 0.8)
  Top 0.305: R20.2 13.17,45.33 13.13,45.37 13.13,46.6 | 13.13,46.6 R21.2 | 47.97,12.82 R18.2 | R19.2 47.93,12.78 47.97,12.82 | 13.13,46.6 v14.95,46.6 | 73.11,71.75 69.94,74.92 | R13.2 31.12,67.43 v34.51,67.43 | v74,45.33 R17.2 80.1,45.37 80.1,47.87 R16.2 | 47.97,12.82 47.97,17.9 62.19,32.13 v63.84,32.13
  Top 0.61: v50.63,67.43 v42.51,67.43 v34.51,67.43 34.51,65.4 30.7,61.59 27.65,61.59 v27.14,62.1 27.14,55.62 | 27.14,55.62 v27.14,52.19 27.14,48.13 v31.84,43.43 | 27.14,55.62 v35.52,55.62 | 69.94,75.05 R12.2 69.94,74.92 | 80.23,70.23 80.23,70.35 78.83,71.75 73.11,71.75 68.8,67.43 v58.89,67.43 v58.89,57.15 60.54,55.49 v60.54,51.68 64.99,47.24 64.99,43.18 | 80.23,70.23 U$2.3 | 80.23,70.23 C2.1 | 64.99,43.18 64.99,36.57 | 64.99,36.57 64.99,33.27 v63.84,32.13 | 64.99,43.18 v65.75,43.18 | 64.99,36.57 v65.62,36.57
  Top 1.626: C3.+ 80.86,63.75 80.23,64.38 U$2.3
  Bottom 0.305: 71.97,44.7 71.97,44.06 71.59,43.68 68.04,43.68 X9.2 66.39,43.82 v65.75,43.18 | 71.97,44.7 R5.2 | R6.2 71.97,46.69 71.97,45.33 | 71.97,44.7 71.97,45.33 | IC1.52 37.89,43 36.92,42.03 33.24,42.03 33.24,43.43 C5.2 | X6.2 20.85,52.5 v14.95,46.6 | IC1.64 38.54,52.6 37.68,53.46 C6.2 36.41,53.46 | C17.2 59.02,55.49 60.08,56.56 CON_SPI1.P$2 | IC1.21 58.01,49.4 58.51,49.91 | v60.54,51.68 60.54,51.3 59.14,49.91 58.51,49.91 | 58.51,49.91 C4.2 | X8.2 66.74,28.34 66.26,28.82 66.26,30.47 64.6,32.13 v63.84,32.13 | X7.2 65.75,36.7 v65.62,36.57 | 71.97,45.33 v74,45.33
  Bottom 0.61: v31.84,43.43 33.24,43.43 | D1.2 32.56,67.47 32.6,67.43 v34.51,67.43 | D2.2 40.81,67.39 40.86,67.43 v42.51,67.43 | D3.2 48.81,67.39 48.86,67.43 v50.63,67.43 53.56,64.51 55.97,64.51 v58.89,67.43 57.11,67.43 57.05,67.37 D4.2 | X10.2 27.11,62.07 v27.14,62.1 | X6.2 27.07,52.5 v27.14,52.19 | 36.41,53.46 36.41,54.73 v35.52,55.62 | C17.2 58.85,55.58 58.89,55.62 v58.89,57.15

### Text on the board
Top: Gorrazoptere | v_0_9 | 06/06
Bottom: Paparazzi